# EAGLE design right (EAGLE 9.6.2)
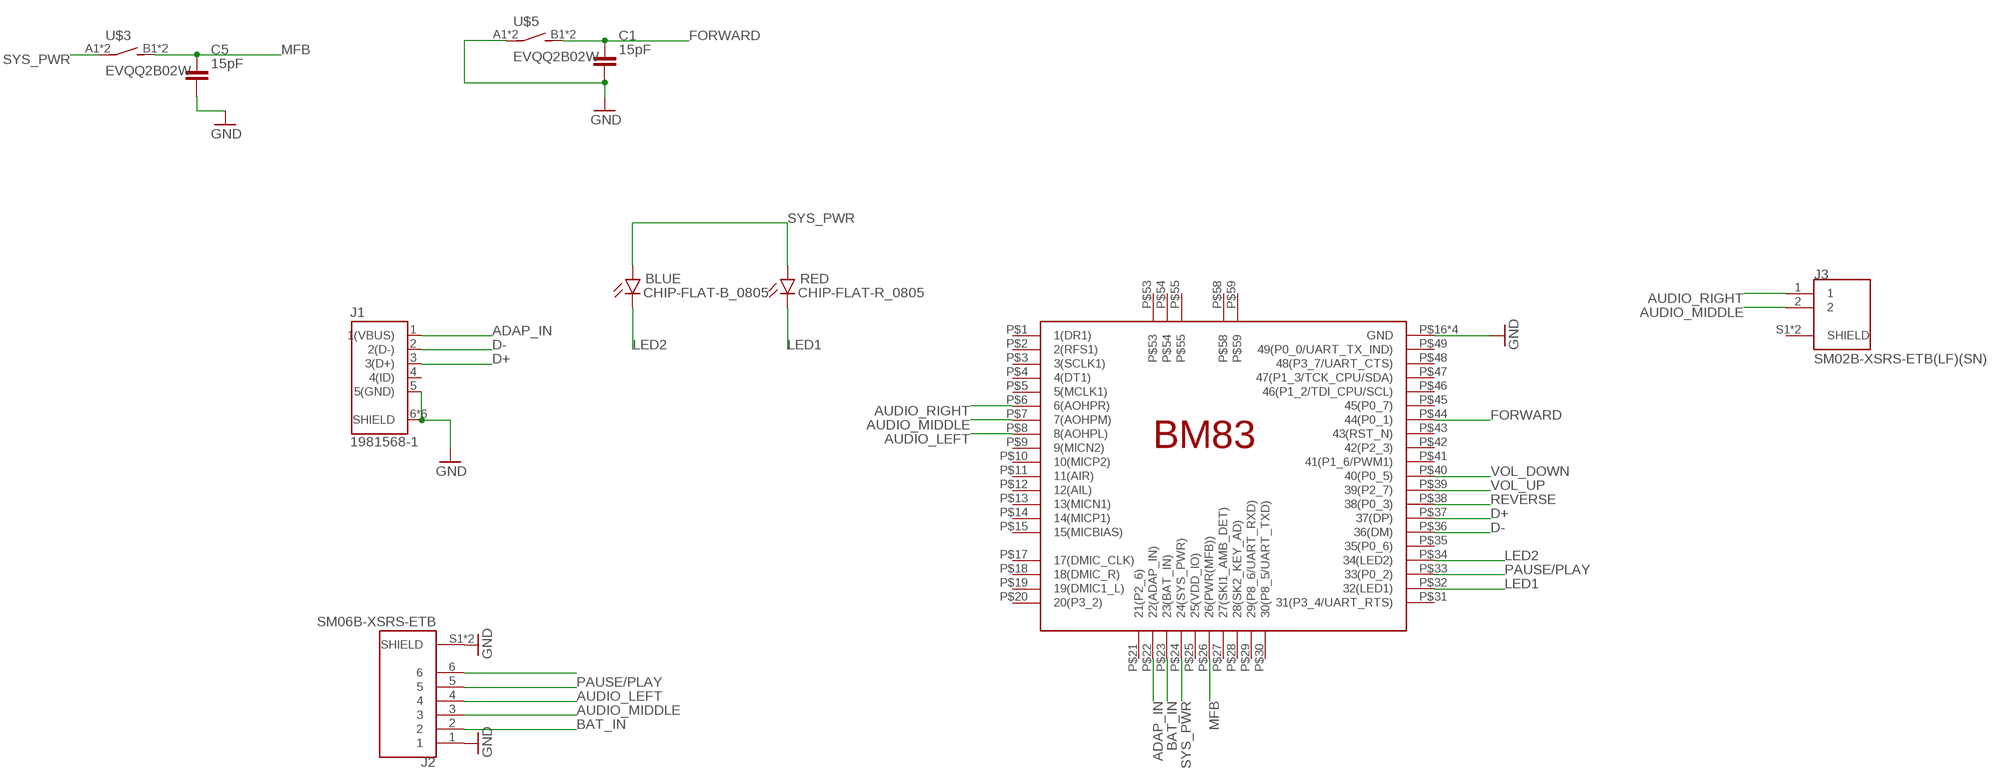
[diagram p0: schematic, sheet 1]

## Parts
BLUE  CHIP-FLAT-B_0805  [LEDC2012X110N]
C1  15pF  C_CHIP-0805(2012-METRIC)  [CAPC2012X110]
C5  15pF  C_CHIP-0805(2012-METRIC)  [CAPC2012X110]
J1  1981568-1  [TE_1981568-1]
J2  SM06B-XSRS-ETB  [JST_SM06B-XSRS-ETB]
J3  SM02B-XSRS-ETB(LF)(SN)  [JST_SM02B-XSRS-ETB(LF)(SN)]
RED  CHIP-FLAT-R_0805  [LEDC2012X110N]
U$1  BM83  [BM83]
U$3  EVQQ2B02W  [EVQQ2B02W]
U$5  EVQQ2B02W  [EVQQ2B02W]

## Nets
ADAP_IN: J1.1(1(VBUS)) U$1.P$22(22(ADAP_IN))
AUDIO_LEFT: J2.4 U$1.P$8(8(AOHPL))
AUDIO_MIDDLE: J2.3 J3.2 U$1.P$7(7(AOHPM))
AUDIO_RIGHT: J3.1 U$1.P$6(6(AOHPR))
BAT_IN: J2.2 U$1.P$23(23(BAT_IN))
D+: J1.3(3(D+)) U$1.P$37(37(DP))
D-: J1.2(2(D-)) U$1.P$36(36(DM))
FORWARD: C1.1 U$1.P$44(44(P0_1)) U$5.B1(S) U$5.B2(S)
GND: C1.2 C5.2 J1.5(5(GND)) J1.6(SHIELD) J1.7(SHIELD) J1.8(SHIELD) J1.9(SHIELD) J1.10(SHIELD) J1.11(SHIELD) J2.1 J2.S1(SHIELD) J2.S2(SHIELD) U$1.P$16(GND) U$1.P$50(GND) U$1.P$56(GND) U$1.P$57(GND) U$5.A1(P) U$5.A2(P)
LED1: RED.C U$1.P$32(32(LED1))
LED2: BLUE.C U$1.P$34(34(LED2))
MFB: C5.1 U$1.P$26(26(PWR(MFB))) U$3.B1(S) U$3.B2(S)
N$1: J2.6
PAUSE/PLAY: J2.5 U$1.P$33(33(P0_2))
REVERSE: U$1.P$38(38(P0_3))
SYS_PWR: BLUE.A RED.A U$1.P$24(24(SYS_PWR)) U$3.A1(P) U$3.A2(P)
VOL_DOWN: U$1.P$40(40(P0_5))
VOL_UP: U$1.P$39(39(P2_7))
Unconnected: J1.4(4(ID)) J3.S1(SHIELD) J3.S2(SHIELD) U$1.P$1(1(DR1)) U$1.P$2(2(RFS1)) U$1.P$3(3(SCLK1)) U$1.P$4(4(DT1)) U$1.P$5(5(MCLK1)) U$1.P$9(9(MICN2)) U$1.P$10(10(MICP2)) U$1.P$11(11(AIR)) U$1.P$12(12(AIL)) U$1.P$13(13(MICN1)) U$1.P$14(14(MICP1)) U$1.P$15(15(MICBIAS)) U$1.P$17(17(DMIC_CLK)) U$1.P$18(18(DMIC_R)) U$1.P$19(19(DMIC1_L)) U$1.P$20(20(P3_2)) U$1.P$21(21(P2_6)) U$1.P$25(25(VDD_IO)) U$1.P$27(27(SKI1_AMB_DET)) U$1.P$28(28(SK2_KEY_AD)) U$1.P$29(29(P8_6/UART_RXD)) U$1.P$30(30(P8_5/UART_TXD)) U$1.P$31(31(P3_4/UART_RTS)) U$1.P$35(35(P0_6)) U$1.P$41(41(P1_6/PWM1)) U$1.P$42(42(P2_3)) U$1.P$43(43(RST_N)) U$1.P$45(45(P0_7)) U$1.P$46(46(P1_2/TDI_CPU/SCL)) U$1.P$47(47(P1_3/TCK_CPU/SDA)) U$1.P$48(48(P3_7/UART_CTS)) U$1.P$49(49(P0_0/UART_TX_IND)) U$1.P$53 U$1.P$54 U$1.P$55 U$1.P$58 U$1.P$59

## Library data of the parts
BLUE = LED:CHIP-FLAT-B; CATEGORY: LED; COLOR: BLUE; DESCRIPTION: CHIP LED FLAT; SUB-CATEGORY: CHIP; TYPE: FLAT_TOP
C1 C5 = Capacitor:C: Capacitor - Generic; CATEGORY: Capacitor
J1 = open_earphones:1981568-1: CONN RCPT MICRO USB B R/A SMD; APPLICATION: POWER & SIGNAL; CONNECTOR: USB-MICRO B; CURRENT_RATING: 1.8; DESIGNATOR: 1981568-1; FINISH: GOLD; FOOTPRINT: SMT; GENDER: Receptacle; LATEST_REVISION_DATE: 13AUG15; LATEST_REVISION_NOTE: REVISED PER ECO-15-009877; MANUFACTURER: TE CONNECTIVITY; MANUFACTURER_LINK: http://www.te.com/commerce/DocumentDelivery/DDEController?Action=showdoc&DocId=Customer+Drawing%7F1981568%7FE2%7Fpdf%7FEnglish%7FENG_CD_1981568_E2.pdf%7F1981568-1; NO_OF_POSITION: 5; ORIENTATION: Right Angle; PACKAGE: USB 2.0; PART_DESCRIPTION: MICRO USB 2.0 PECEPTACLE CONNECTOR R/A TYPE B ASSEMBLY; PART_REV: E2; PITCH: 0.65mm; PUBISHER: TE CONNECTIVITY; PUBLISHED: 07AUG2007; ROHS_COMPLIANT: YES; SERIES: MICRO USB 2.0; STANDARD: MANUFACTURER RECOMMENDATIONS; TECHNOLOGY: Cable-to-Board; TE_PART_NUMBER: 1981568-1; TYPE: USB 2.0 RECEPTACLE
J2 = open_earphones:SM06B-XSRS-ETB: CONN HEADER SMD R/A 6POS 0.6MM; MANUFACTURER: JST; STANDARD: Manufacturer Recommendations
J3 = open_earphones:SM02B-XSRS-ETB(LF)(SN): CONN HEADER SMD R/A 2POS 0.6MM; MANUFACTURER: JST; STANDARD: Manufacturer Recommendations
RED = LED:CHIP-FLAT-R; CATEGORY: LED; COLOR: RED; DESCRIPTION: CHIP LED FLAT; SUB-CATEGORY: CHIP; TYPE: FLAT_TOP
U$1 = open_earphones:BM83
U$3 U$5 = open_earphones:EVQQ2B02W

## Board
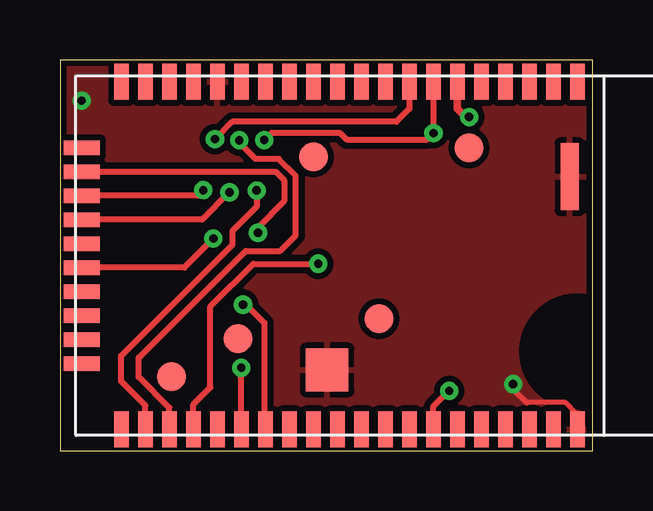
[diagram p1: board, top side]
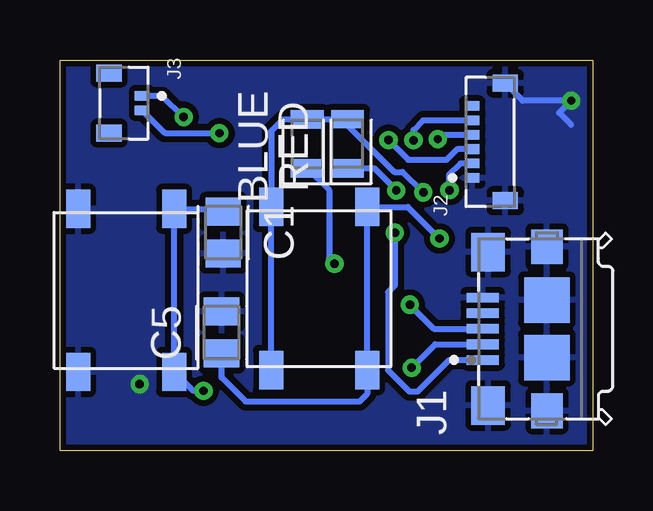
[diagram p2: board, bottom side, seen from below]

Size 22.2 x 16.3 mm. Coordinates in mm from the lower left corner, seen from the top.
Outline: 0,0 22.2,0 22.2,16.3 0,16.3 0,0
Copper layers (1*16): Top 0.035mm / dielectric 0.73mm / Bottom 0.035mm
Design rules "default *": minimum track width 6mil, minimum drill 0.35mm, track to track 6mil, track to pad 6mil, pad to pad 6mil, via to via 6mil, smd to smd 6mil, copper to edge 5mil, drill to drill 6mil, minimum pad ring 10mil, minimum via ring 8mil, stop-mask expansion 0mil, vias tented up to drill 0mil, thermal gap 10mil

### Footprints (pad centres in the part's own frame; a part is rotated, then mirrored left to right if it is on the bottom)
LEDC2012X110N = smd 0.762 x 1.362: A 1.025,0; C -1.025,0
CAPC2012X110 = smd 1.165 x 1.465: 1 -0.875,0; 2 0.875,0
TE_1981568-1 = smd 0.4 x 1.35: 1 -1.3,2.675; 2 -0.65,2.675; 3 0,2.675; 4 0.65,2.675; 5 1.3,2.675 | smd 1.6 x 1.4: 6 -3.2,2.45; 7 3.2,2.45 | smd 1.45 x 1.3: 8 3.425,0; 9 -3.425,0 | smd 1.9 x 1.9: 10 -1.2,0; 11 1.2,0
JST_SM06B-XSRS-ETB = smd 0.4 x 0.6: 1 -1.5,1.375; 2 -0.9,1.375; 3 -0.3,1.375; 4 0.3,1.375; 5 0.9,1.375; 6 1.5,1.375 | smd 0.7 x 1.05: S1 -2.45,0; S2 2.45,0
JST_SM02B-XSRS-ETB(LF)(SN) = smd 0.4 x 0.6: 1 -0.3,1.375; 2 0.3,1.375 | smd 0.7 x 1.05: S1 -1.25,0; S2 1.25,0
BM83 = smd 1.5 x 0.6: P$1 0.25,20.9; P$2 0.25,19.9; P$3 0.25,18.9; P$4 0.25,17.9; P$5 0.25,16.9; P$6 0.25,15.9; P$7 0.25,14.9; P$8 0.25,13.9; P$9 0.25,12.9; P$10 0.25,11.9; P$11 0.25,10.9; P$12 0.25,9.9; P$13 0.25,8.9; P$14 0.25,7.9; P$15 0.25,6.9; P$16 0.25,5.9; P$17 0.25,4.9; P$18 0.25,3.9; P$19 0.25,2.9; P$20 0.25,1.9; P$31 14.75,1.9; P$32 14.75,2.9; P$33 14.75,3.9; P$34 14.75,4.9; P$35 14.75,5.9; P$36 14.75,6.9; P$37 14.75,7.9; P$38 14.75,8.9; P$39 14.75,9.9; P$40 14.75,10.9; P$41 14.75,11.9; P$42 14.75,12.9; P$43 14.75,13.9; P$44 14.75,14.9; P$45 14.75,15.9; P$46 14.75,16.9; P$47 14.75,17.9; P$48 14.75,18.9; P$49 14.75,19.9; P$50 14.75,20.9 | smd 0.6 x 1.5: P$21 3,0.25; P$22 4,0.25; P$23 5,0.25; P$24 6,0.25; P$25 7,0.25; P$26 8,0.25; P$27 9,0.25; P$28 10,0.25; P$29 11,0.25; P$30 12,0.25 | smd 1.2 x 1.2: P$53 10.13,12.63; P$54 10.97,6.76; P$55 12.55,3.99; P$58 3,16.38; P$59 3.38,9.91 | smd 1.78 x 1.78: P$56 12.27,10.47 | smd 2.79 x 0.76: P$57 4.21,20.58
EVQQ2B02W = smd 1.6 x 1: A1 -3.4,-2; A2 3.4,-2; B1 -3.4,2; B2 3.4,2

### Placement (x,y rotation side)
BLUE  11.9,12.8 90 bottom
C1  15.4,9.1 270 bottom
C5  15.47,4.93 90 bottom
J1  1.91,5.09 90 bottom
J2  3.65,12.88 90 bottom
J3  20.16,14.5 270 bottom
RED  10.22,12.81 90 bottom
U$1  0.66,15.64 270 top
U$3  11.41,6.77 270 bottom
U$5  19.44,6.69 270 bottom

### Tracks (layer width: path | path; a pad name or v marks a point on that pad's centre or on a via)
ADAP_IN  (via drill 0.35)
  Top 0.254: U$1.P$22 8.98,11.64 9.34,11.28 9.34,10.41 8.25,9.32 v8.25,9.09
  Bottom 0.254: v8.25,9.09 8.25,6.9 8.53,6.62 8.53,3.36 7.64,2.47 7.3,2.47 5.98,3.79 J1.1
AUDIO_LEFT  (via drill 0.35)
  Top 0.254: U$1.P$8 14.56,14.26 14.02,13.72 7.18,13.72 v6.46,13
  Bottom 0.254: v6.46,13 6.28,13.18 J2.4
AUDIO_MIDDLE  (via drill 0.35)
  Top 0.254: U$1.P$7 v15.56,13.25 15.29,12.98 11.94,12.98 11.68,13.24 8.79,13.24 v8.51,12.96
  Bottom 0.254: v8.51,12.96 7.69,12.14 6.1,12.14 5.66,12.58 J2.3 | J3.2 17.83,13.25 v15.56,13.25
AUDIO_RIGHT  (via drill 0.35)
  Top 0.254: v17.05,13.92 16.99,13.92 16.95,13.88
  Top 0.305: U$1.P$6 16.56,14.27 16.95,13.88
  Bottom 0.254: v17.05,13.92 17.93,14.8 J3.1
BAT_IN  (via drill 0.35)
  Top 0.254: v5.97,10.87 5.74,10.64 U$1.P$23
  Bottom 0.254: J2.2 5.51,11.98 6,11.49 6,10.9 v5.97,10.87
D+  (via drill 0.35)
  Top 0.254: v7.62,6.09 7.76,6.09 8.51,5.34 8.51,0.94 U$1.P$37
  Bottom 0.254: v7.62,6.09 6.62,5.09 J1.3
D-  (via drill 0.35)
  Top 0.254: U$1.P$36 v7.56,3.45 v7.55,3.46
  Bottom 0.254: v7.55,3.46 6.57,4.44 J1.2
FORWARD  (via drill 0.35)
  Top 0.254: U$1.P$44 15.56,1.86 v16.21,2.51 v16.22,2.5
  Bottom 0.254: U$5.B1 17.4,10.09 | 17.4,10.09 15.51,10.09 C1.1 | v16.22,2.5 16.65,2.5 U$5.B2 17.44,10.05 17.4,10.09
GND  (via drill 0.35)
  Top 0.2: U$1.P$50 21.56,1.52 21.07,2.01 19.45,2.01
  Top 0.254: 19.45,2.01 19.02,2.44 19.02,2.78 v18.88,2.78
  Bottom 0.254: 0.9,13.6 1.4,14.1 v0.9,14.6 2.92,14.6 J2.S2
  pour Top (isolate 0.254): -0.61,-0.87 -0.61,18.18 22.25,18.18 22.25,-0.87
  pour Bottom (isolate 0.254): -0.61,-0.87 -0.61,18.18 22.25,18.18 22.25,-0.87
LED1  (via drill 0.35)
  Top 0.254: v8.19,10.86 8.19,10.18 7.18,9.17 7.18,8.59 2.55,3.96 2.55,2.9 3.56,1.89 U$1.P$32
  Bottom 0.254: RED.C 9.1,11.79 8.19,10.88 v8.19,10.86
LED2  (via drill 0.35)
  Top 0.254: U$1.P$34 5.56,1.93 6.27,2.64 6.27,6.01 8.06,7.8 v10.76,7.8
  Bottom 0.254: BLUE.C 10.99,10.87 10.99,8.03 v10.76,7.8
MFB  (via drill 0.35)
  Top 0.254: v6.39,8.85 5.18,7.64 U$1.P$26
  Bottom 0.254: C5.1 15.47,3.06 14.47,2.06 9.72,2.06 9.41,2.37 U$3.B2 U$3.B1 7.71,10.17 v6.39,8.85
PAUSE/PLAY  (via drill 0.35)
  Top 0.254: U$1.P$33 4.56,1.8 3.28,3.08 3.28,3.88 7.74,8.34 9.17,8.34 9.81,8.98 9.81,11.47 9.12,12.17 8.15,12.17 7.47,12.85 v7.47,12.95
  Bottom 0.254: v7.47,12.95 7.47,13.38 7.07,13.78 J2.5
SYS_PWR  (via drill 0.35)
  Top 0.254: v7.06,10.78 5.92,9.64 U$1.P$24
  Bottom 0.254: U$3.A2 U$3.A1 13.41,13.32 12.91,13.82 BLUE.A 10.23,13.82 RED.A 10.22,13.58 8.27,11.63 7.93,11.63 7.08,10.78 v7.06,10.78